# Altium schematic sheet Microcontroller.SchDoc
size A3; DocumentNumber: 8; SheetNumber: 8; SheetTotal: 9
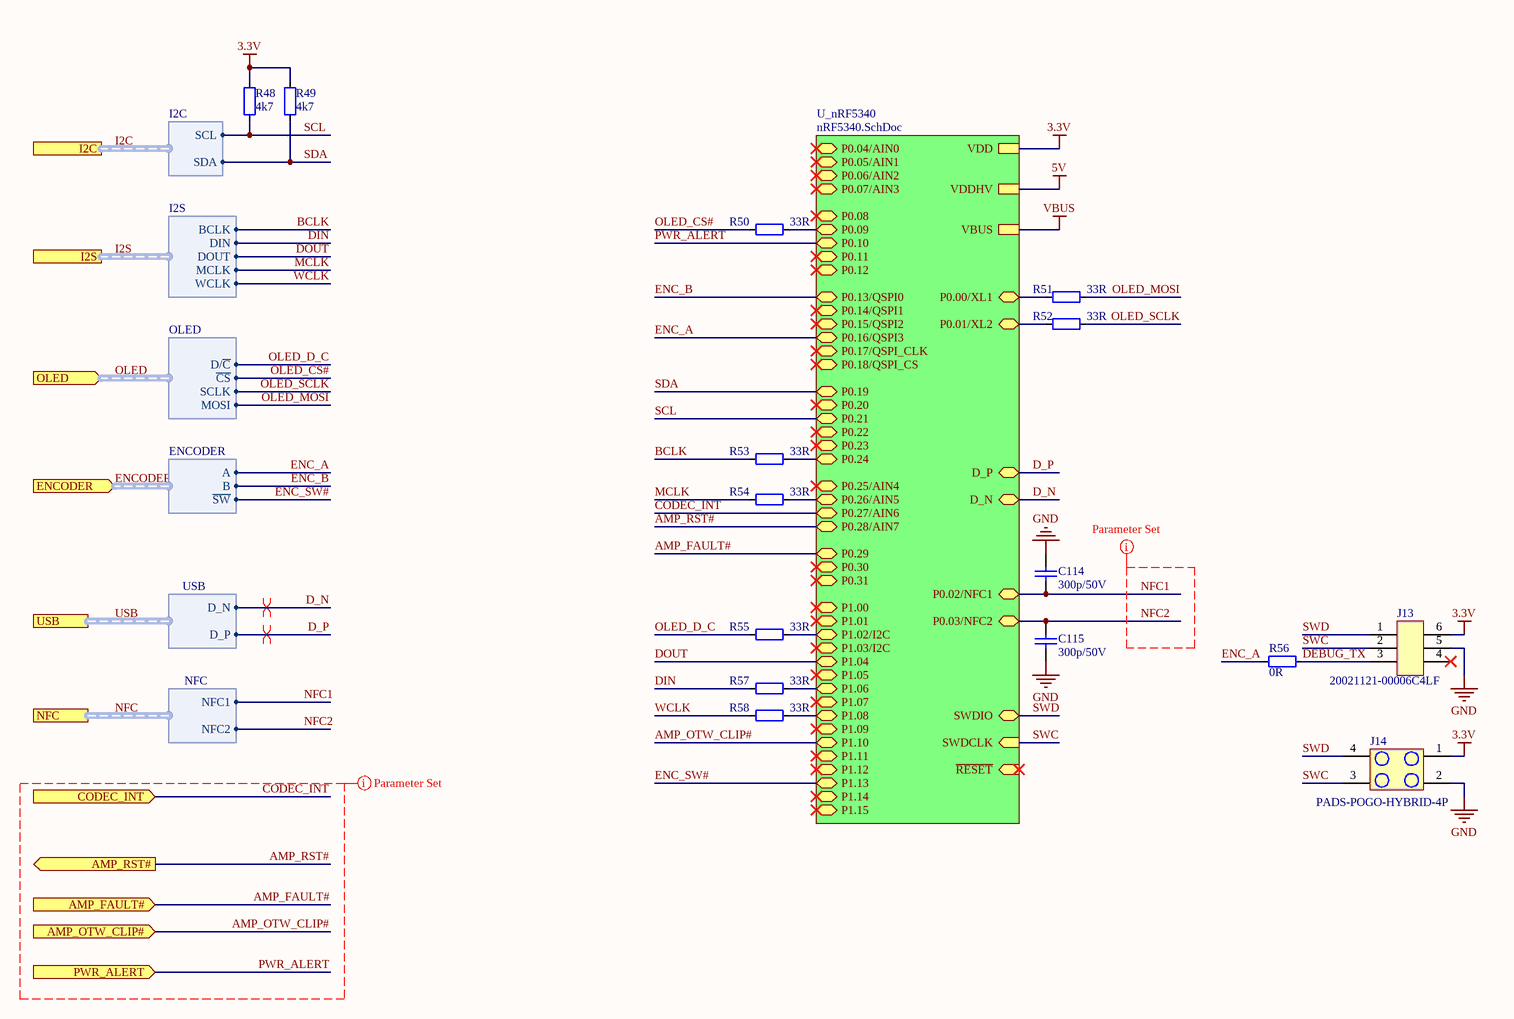
[diagram p0: Microcontroller.SchDoc]

## Parts
C114  300p/50V  [C0402]
C115  300p/50V  [C0402]
J13  20021121-00006C4LF  [20021121-00006C4LF]
J14  PADS-POGO-HYBRID-4P  [PADS-POGO-HYBRID-4P]
R48  4k7  [R0402]
R49  4k7  [R0402]
R50  33R  [R0402]
R51  33R  [R0402]
R52  33R  [R0402]
R53  33R  [R0402]
R54  33R  [R0402]
R55  33R  [R0402]
R56  0R  [R0402]
R57  33R  [R0402]
R58  33R  [R0402]

## Sub-sheets
U_nRF5340 = nRF5340.SchDoc: D_N (bidir), D_P (bidir), SWDIO (bidir), SWDCLK (in), P0.02/NFC1 (bidir), VDD, VDDHV, VBUS, ~{RESET} (in), P0.03/NFC2 (bidir), P0.04/AIN0 (bidir), P0.05/AIN1 (bidir), P0.06/AIN2 (bidir), P0.07/AIN3 (bidir), P0.08 (bidir), P0.09 (bidir), P0.10 (bidir), P0.11 (bidir), P0.12 (bidir), P0.13/QSPI0 (bidir), P0.14/QSPI1 (bidir), P0.15/QSPI2 (bidir), P0.16/QSPI3 (bidir), P0.17/QSPI_CLK (bidir), P0.18/QSPI_CS (bidir), P0.19 (bidir), P0.20 (bidir), P0.21 (bidir), P0.22 (bidir), P0.23 (bidir), P0.24 (bidir), P0.25/AIN4 (bidir), P0.26/AIN5 (bidir), P0.27/AIN6 (bidir), P0.28/AIN7 (bidir), P0.29 (bidir), P0.30 (bidir), P0.31 (bidir), P1.00 (bidir), P1.01 (bidir), P1.02/I2C (bidir), P1.03/I2C (bidir), P1.04 (bidir), P1.05 (bidir), P1.06 (bidir), P1.07 (bidir), P1.08 (bidir), P1.09 (bidir), P1.10 (bidir), P1.11 (bidir), P1.12 (bidir), P1.13 (bidir), P1.14 (bidir), P1.15 (bidir), P0.00/XL1 (bidir), P0.01/XL2 (bidir)

## Ports
AMP_FAULT# (in), AMP_OTW_CLIP# (in), AMP_RST# (out), CODEC_INT (in), ENCODER (in, harness ENCODER), I2C (harness I2C), I2S (harness I2S), NFC (harness NFC), OLED (in, harness OLED), PWR_ALERT (in), USB (harness USB)

## Harnesses
I2C: SCL, SDA
I2S: BCLK, DIN, DOUT, MCLK, WCLK
OLED: ~{CS}, D/~{C}, MOSI, SCLK
ENCODER: A, B, ~{SW}
USB: D_N, D_P
NFC: NFC1, NFC2

## Nets
3.3V: J13.6 J14.1 R48.2 R49.2 ; sheet U_nRF5340/VDD
5V: sheet U_nRF5340/VDDHV
GND: C114.2 C115.1 J13.5 J14.2
VBUS: sheet U_nRF5340/VBUS
AMP_FAULT#: port AMP_FAULT#, sheet U_nRF5340/P0.29
AMP_OTW_CLIP#: port AMP_OTW_CLIP#, sheet U_nRF5340/P1.10
AMP_RST#: port AMP_RST#, sheet U_nRF5340/P0.28/AIN7
BCLK: R53.1 ; port I2S.BCLK
CODEC_INT: port CODEC_INT, sheet U_nRF5340/P0.27/AIN6
D_N: sheet U_nRF5340/D_N, port USB.D_N
D_P: sheet U_nRF5340/D_P, port USB.D_P
DEBUG_TX: J13.3 R56.2
DIN: R57.1 ; port I2S.DIN
DOUT: sheet U_nRF5340/P1.04, port I2S.DOUT
ENC_A: R56.1 ; sheet U_nRF5340/P0.16/QSPI3, port ENCODER.A
ENC_B: sheet U_nRF5340/P0.13/QSPI0, port ENCODER.B
ENC_SW#: sheet U_nRF5340/P1.13, port ENCODER.~{SW}
MCLK: R54.1 ; port I2S.MCLK  [project net I2S.MCLK]
NFC1: C114.1 ; sheet U_nRF5340/P0.02/NFC1, port NFC.NFC1  [project net NFC.NFC1]
NFC2: C115.2 ; sheet U_nRF5340/P0.03/NFC2, port NFC.NFC2  [project net NFC.NFC2]
OLED_CS#: R50.1 ; port OLED.~{CS}  [project net OLED.~{CS}]
OLED_D_C: R55.1 ; port OLED.D/~{C}  [project net OLED.D/~{C}]
OLED_MOSI: R51.1 ; port OLED.MOSI  [project net OLED.MOSI]
OLED_SCLK: R52.1 ; port OLED.SCLK  [project net OLED.SCLK]
PWR_ALERT: port PWR_ALERT, sheet U_nRF5340/P0.10
SCL: R48.1 ; sheet U_nRF5340/P0.21, port I2C.SCL  [project net I2C.SCL]
SDA: R49.1 ; sheet U_nRF5340/P0.19, port I2C.SDA  [project net I2C.SDA]
SWC: J13.2 J14.3 ; sheet U_nRF5340/SWDCLK
SWD: J13.1 J14.4 ; sheet U_nRF5340/SWDIO
WCLK: R58.1 ; port I2S.WCLK  [project net I2S.WCLK]
NetR50_2: R50.2 ; sheet U_nRF5340/P0.09
NetR51_2: R51.2 ; sheet U_nRF5340/P0.00/XL1
NetR52_2: R52.2 ; sheet U_nRF5340/P0.01/XL2
NetR53_2: R53.2 ; sheet U_nRF5340/P0.24
NetR54_2: R54.2 ; sheet U_nRF5340/P0.26/AIN5
NetR55_2: R55.2 ; sheet U_nRF5340/P1.02/I2C
NetR57_2: R57.2 ; sheet U_nRF5340/P1.06
NetR58_2: R58.2 ; sheet U_nRF5340/P1.08

Not connected (* = marked no-connect by the designer): J13 4*

## Buses and harness runs
harness ENCODER = port ENCODER
harness I2C = port I2C
harness I2S = port I2S
harness NFC = port NFC
harness OLED = port OLED
harness USB = port USB

## Layout directives
differential pair: D_N, D_P
net class DIGITAL_SIGNALS: AMP_FAULT#, AMP_OTW_CLIP#, AMP_RST#, CODEC_INT, PWR_ALERT
net class NFC: NFC1, NFC2

## Notes on the sheet
- Title
- Date:
- Number:
- Revision:
- Sheet
- of
- File:
- Author

## Library data of the parts
C114 C115 = 300p 50V X7R 0402: Manufacturer Part Number 1: CC0402KRX7R9BB301; Manufacturer 1: Yageo; Voltage: 50V; Tolerance: 10%; Specifications: X7R 300p 50V ±10%; Capacitance: 300p; Dielectric: X7R; Supplier 1: Mouser; Supplier Part Number 1: 603-CC0402KR9BB301
J13 = 20021121-00006C4LF: Connector Header Surface Mount 6 position 0.050" (1.27mm); Manufacturer 1: AMPHENOL ICC; Manufacturer Part Number 1: 20021121-00006C4LF; ComponentLink1Description: Datasheet; ComponentLink1URL: https://cdn.amphenol-icc.com/media/wysiwyg/files/drawing/20021121.pdf?__cf_chl_jschl_tk__=3dd5f28909d7b594ee28d46c9ed8f43700ae6f44-1596631605-0-ATkpzJL9TJu5FzfHdunZMmaqnR7r0Qv7snR3CT3UcrPbezJeDjnuGYEt9Icu5rIENpFvesAaxI1JprcOJqVCx--MldxHNP4cFD73HanaDcvKPajA5uzqtEkqfZFGs9vAT18J9ERX3JpJjT1NnL0Wpd_o0_HjBdrr38dsqxhFuKB3xDfcgAo_3Kc4TXKaTbGDXbsuVDNwVEquLSBLkUGRwDr4gRRD1vSEfgnEf5WjMvHMM99kTZrmwlUvHq_okpXBPoEm5lOyPGLHTIguALaj068LjevqrZNhKizCyxJfy6dRFp5Xmb_qgPb5HMl6zMfbZz-NLi2y3eDG5wjAfmg-LL4dpny0k2FZ_9MjdEs4MfLtzLiwnoMuDt3u_K_4OCKDYOPBmtEiCntVRR4GHwvceDo; Price @ 10k: 0.18; Supplier 1: Farnell; Supplier Part Number 1: 1865277
J14 = PADS-POGO-HYBRID-4P: Pads for 4 pin programming pogoor smd header; Manufacturer 1: AMPHENOL ICC; Manufacturer Part Number 1: 20021121-00004C4LF; Supplier 1: Farnell; Supplier Part Number 1: 1865276; ComponentLink1Description: Datasheet; ComponentLink1URL: https://www.farnell.com/cad/2354041.pdf
R48 R49 = 4k7 63mW 50V 0402: Manufacturer Part Number 1: AC0402FR-134K7L; Manufacturer 1: Yageo; Power Rating: 63mW; Tolerance: 1%; Voltage: 50V; Resistance: 4k7; Specifications: =Resistance+ ' '+"Power Rating "+Voltage+' ±'+Tolerance; Supplier 1: Mouser; Supplier Part Number 1: 603-AC0402FR-134K7L
R50-R55 R57 R58 = 33R 63mW 50V 0402: Manufacturer Part Number 1: CRCW040233R0JNEDC; Manufacturer 1: Vishay; Power Rating: 63mW; Tolerance: 5%; Voltage: 50V; Resistance: 33R; Specifications: =Resistance+ ' '+"Power Rating "+Voltage+' ±'+Tolerance; Supplier 1: Mouser; Supplier Part Number 1: 71-CRCW040233R0JNEDC
R56 = 0R 63mW 50V 0402: Manufacturer Part Number 1: CRCW04020000Z0EDC; Manufacturer 1: Vishay; Power Rating: 63mW; Tolerance: 1%; Voltage: 50V; Resistance: 0R; Specifications: =Resistance+ ' '+"Power Rating "+Voltage+' ±'+Tolerance; Supplier 1: Mouser; Supplier Part Number 1: 71-CRCW04020000Z0EDC